# Altium schematic sheet CON_MEZZANINE_ADC.SchDoc: Mezzanine ADC connector
size 297 x 209 mm; Author: P. Zdunek; DrawnBy: P. Zdunek; DocumentNumber: 9; SheetNumber: 9; SheetTotal: 36
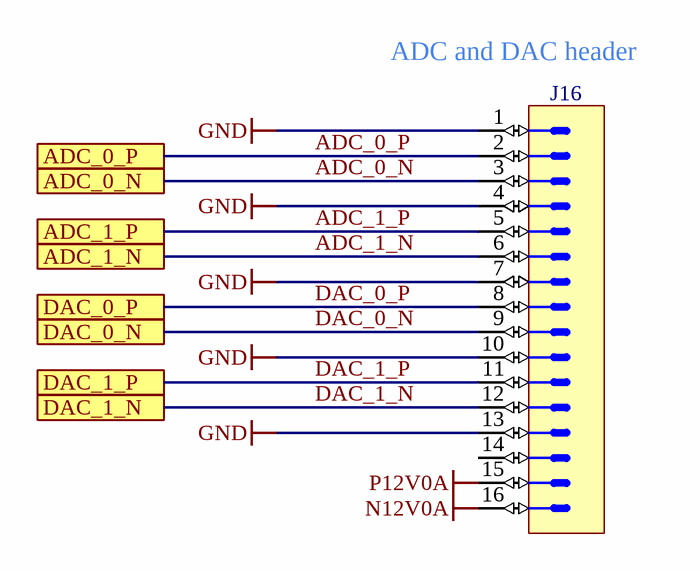
[diagram p0: CON_MEZZANINE_ADC.SchDoc]

## Parts
J16  Header 16  [3M_N2516-6002RB]  (value not drawn)

## Ports
ADC_0_N, ADC_0_P, ADC_1_N, ADC_1_P, DAC_0_N, DAC_0_P, DAC_1_N, DAC_1_P

## Nets
GND: J16.1 J16.4 J16.7 J16.10 J16.13
N12V0A: J16.16
P12V0A: J16.15
ADC_0_N: J16.3 ; port ADC_0_N
ADC_0_P: J16.2 ; port ADC_0_P
ADC_1_N: J16.6 ; port ADC_1_N
ADC_1_P: J16.5 ; port ADC_1_P
DAC_0_N: J16.9 ; port DAC_0_N
DAC_0_P: J16.8 ; port DAC_0_P
DAC_1_N: J16.12 ; port DAC_1_N
DAC_1_P: J16.11 ; port DAC_1_P

Not connected (* = marked no-connect by the designer): J16 14

## Notes on the sheet
- (near J16) ADC and DAC header
- Project
- Document
- Designer
- Drawn by
- Check.by
- File
- Last Mod.
- Print Date
- Sheet
- Size
- A4
- of
- Rev

## Library data of the parts
J16 = 3M_N2516-6002RB: Connector 16 Male; Part Description: 16 Contacts - Straight .100'' x .100'' Low Profile Four-Wall Header, 2500 Series; Manufacturer: 3M; PressFit: No; Part Number: 3M_N2516-6002RB; Component Kind: Standard; Component Type: Standard; Pin Count: 16; Family: Header 16; Mounted: Yes; Socket: No; SMD: No; Sense: No; Status: None; Manufacturer Part Number: N2516-6002RB; ComponentHeight: 10.03mm; HelpURL: \\cern.ch\dfs\Applications\Altium\Datasheets\3M_N2516-6002RB.pdf; Author: CERN DEM JLC; CreateDate: 11.02.2009; LatestRevisionDate: 11.08.2009